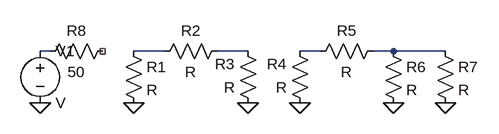
[diagram p0: schematic attenuator.asc]
attenuator.asc, the LTspice schematic file:
Version 4
SHEET 1 880 680
WIRE -64 112 -80 112
WIRE 112 112 64 112
WIRE 240 112 192 112
WIRE 352 112 320 112
WIRE 464 112 432 112
WIRE 544 112 464 112
FLAG 64 192 0
FLAG 240 192 0
FLAG 320 192 0
FLAG 464 192 0
FLAG 544 192 0
FLAG -80 192 0
SYMBOL res 48 96 R0
SYMATTR InstName R1
SYMBOL res 208 96 R90
WINDOW 0 0 56 VBottom 2
WINDOW 3 32 56 VTop 2
SYMATTR InstName R2
SYMBOL res 256 208 R180
WINDOW 0 36 76 Left 2
WINDOW 3 36 40 Left 2
SYMATTR InstName R3
SYMBOL res 336 208 R180
WINDOW 0 36 76 Left 2
WINDOW 3 36 40 Left 2
SYMATTR InstName R4
SYMBOL res 336 128 R270
WINDOW 0 32 56 VTop 2
WINDOW 3 0 56 VBottom 2
SYMATTR InstName R5
SYMBOL res 448 96 R0
SYMATTR InstName R6
SYMBOL res 528 96 R0
SYMATTR InstName R7
SYMBOL res 32 96 R90
WINDOW 0 0 56 VBottom 2
WINDOW 3 32 56 VTop 2
SYMATTR InstName R8
SYMATTR Value 50
SYMBOL voltage -80 96 R0
SYMATTR InstName V1

The netlist it stands for:
* attenuator.asc
R1 N002 0 R
R2 N003 N002 R
R3 0 N003 R
R4 0 N004 R
R5 N004 N005 R
R6 N005 0 R
R7 N005 0 R
R8 NC_01 N001 50
V1 N001 0 V
.backanno
.end